# Altium project MQ-2_Module.PrjPcb
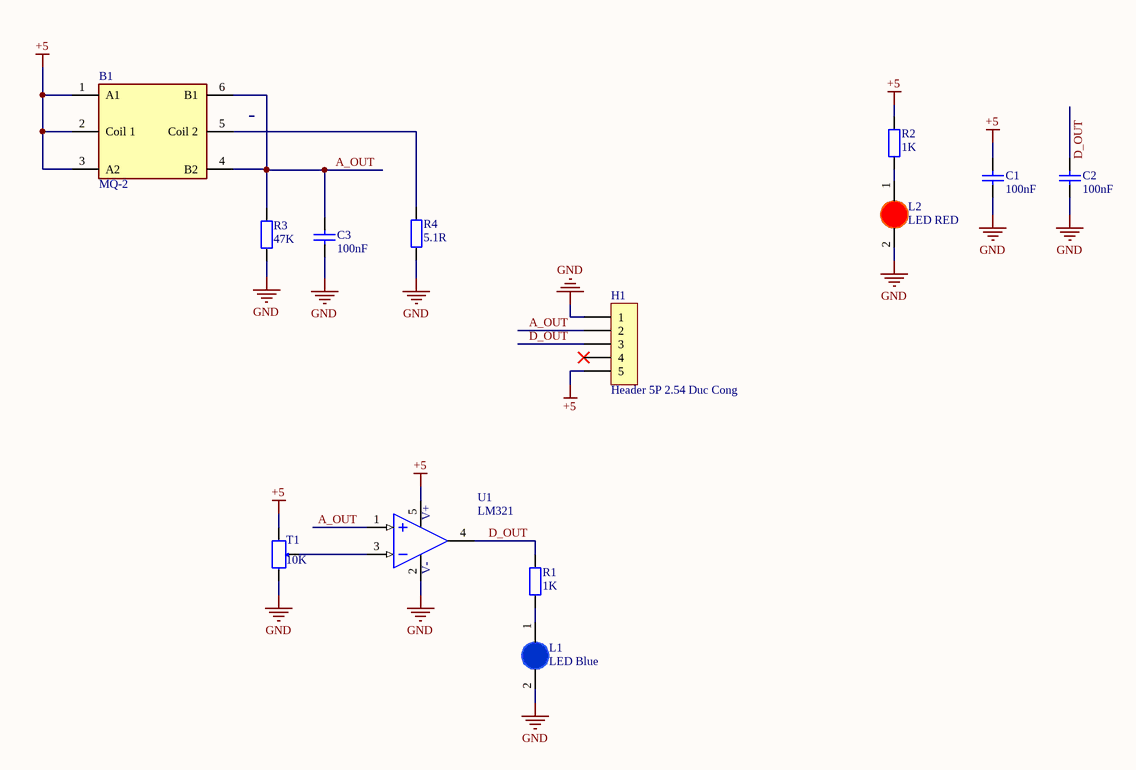
[diagram p0: MQ-2_SCH.SchDoc]
1 sheet, 13 parts. Net scope: global (net labels, ports and power ports of the same name join across sheets).
Board file: MQ-2_PCB.PcbDoc

## Sheet MQ-2_SCH.SchDoc
size A4; SheetNumber: 1; SheetTotal: 1

### Parts
B1  MQ-2  [MQ2]
C1  100nF  [tu 0603]
C2  100nF  [tu 0603]
C3  100nF  [tu 0603]
H1  Header 5P 2.54 Duc Cong  [Header 5P DC 2.54]
L1  LED Blue  [LED-0805-Blue]
L2  LED RED  [LED-0805-Red]
R1  1K  [tro smd 0603]
R2  1K  [tro smd 0603]
R3  47K  [tro smd 0603]
R4  5.1R  [tro smd 0603]
T1  10K  [Bien Tro Vi Chinh Dung]
U1  LM321  [sot23-5]

### Nets
+5: B1.1(A1) B1.2(Coil_1) B1.3(A2) C1.1 H1.5 R2.2 T1.3 U1.5(V+)
GND: C1.2 C2.2 C3.2 H1.1 L1.2(K) L2.2(K) R3.1 R4.1 T1.1 U1.2(V-)
A_OUT: B1.4(B2) B1.6(B1) C3.1 H1.2 R3.2 U1.1(IN+)
D_OUT: C2.1 H1.3 R1.2 U1.4(-V)
NetB1_5: B1.5(Coil_2) R4.2
NetL1_1: L1.1(A) R1.1
NetL2_1: L2.1(A) R2.1
NetT1_2: T1.2 U1.3(IN-)

Not connected (* = marked no-connect by the designer): H1 4*

### Library data of the parts
B1 = MQ-2: Sensor: gas; smoke,combustible gases; Range: 30010000ppm; MQ-2; Manufacturer_Name: WINSEN; Geometry.Height: 15mm; Manufacturer_Part_Number: MQ-2; Mouser Part Number: *; Mouser Price/Stock: *; Arrow Part Number: *; Arrow Price/Stock: *; Datasheet Link: https://www.tme.com/Document/9f6250807cbcd9cc73a92775a9c66d2e/MQ-2.pdf
C1-C3 = Tu 0603 104 50V 10%: Dán; Don_Vi: Con; So_Chan: 2; Ten_Linh_Kien: Tụ 0603 104-100nF 10% 50V; Ma_Hang: MH004568; Chung_Loai: Dán; Kieu_Chan: *
H1 = Header 5P 2.54 Duc Cong: Cắm; Ten_Linh_Kien: Header 5P XH2.54-5P Đực Cong; Don_Vi: Con; Ma_Hang: MH001308; Chung_Loai: Cắm
L1 = LED 0805 Xanh Duong: Dán; Don_Vi: Con; Ma_Hang: MH002327; Ten_Linh_Kien: LED 0805 Màu Xanh Dương (Blue); Ghi_Chu: *; Kieu_Chan: *; Chung_Loai: Dán
L2 = LED 0805 Do: Dán; Don_Vi: Con; Ma_Hang: MH000897; Ten_Linh_Kien: LED 0805 Màu Đỏ (Red); Ghi_Chu: *; Kieu_Chan: *; Chung_Loai: Dán
R1 R2 = Tro 0603 1% 1k: Dán; So_Chan: 2; Don_Vi: Con; Ten_Linh_Kien: Trở 0603 1% 1k; Ma_Hang: MH006334; Chung_Loai: Dán; Kieu_Chan: *
R3 R4 = Tro 0603 5% 47k: Dán; Chung_loai: Dám; Don_Vi: Con; So_Chan: 2; Ten_Linh_Kien: Trở 0603 5% 47k; Ma_Hang: MH007665; Kieu_Chan: *
T1 = Bien Tro Tinh Chinh 10K Dung: Cắm; Ma_Hang: MH003232; Ten_Linh_Kien: Biến Trở VR 103-10K 3296W; Don_Vi: Con; Kieu_Chan: *; Chung_Loai: Cắm; Ghi_Chu: *
U1 = LM321: Opamp